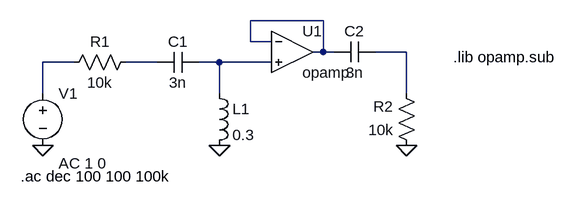
[diagram p0: schematic pasivo.asc]
pasivo.asc, the LTspice schematic file:
Version 4
SHEET 1 880 680
WIRE 320 0 208 0
WIRE 208 32 208 0
WIRE 240 32 208 32
WIRE 320 48 320 0
WIRE 320 48 304 48
WIRE 336 48 320 48
WIRE 448 48 400 48
WIRE -64 64 -112 64
WIRE 64 64 16 64
WIRE 160 64 128 64
WIRE 240 64 160 64
WIRE -112 112 -112 64
WIRE 160 112 160 64
WIRE 448 112 448 48
FLAG -112 192 0
FLAG 448 192 0
FLAG 160 192 0
SYMBOL res 32 48 R90
WINDOW 0 0 56 VBottom 2
WINDOW 3 32 56 VTop 2
SYMATTR InstName R1
SYMATTR Value 10k
SYMBOL res 464 208 R180
WINDOW 0 36 76 Left 2
WINDOW 3 36 40 Left 2
SYMATTR InstName R2
SYMATTR Value 10k
SYMBOL cap 128 48 R90
WINDOW 0 0 32 VBottom 2
WINDOW 3 32 32 VTop 2
SYMATTR InstName C1
SYMATTR Value 3n
SYMBOL cap 400 32 R90
WINDOW 0 0 32 VBottom 2
WINDOW 3 32 32 VTop 2
SYMATTR InstName C2
SYMATTR Value 3n
SYMBOL ind 144 96 R0
SYMATTR InstName L1
SYMATTR Value 0.3
SYMBOL Opamps\\opamp 272 -16 R0
SYMATTR InstName U1
SYMBOL voltage -112 96 R0
WINDOW 123 24 124 Left 2
WINDOW 39 0 0 Left 2
SYMATTR InstName V1
SYMATTR Value ""
SYMATTR Value2 AC 1 0
TEXT 520 56 Left 2 !.lib opamp.sub
TEXT -146 240 Left 2 !.ac dec 100 100 100k

The netlist it stands for:
* pasivo.asc
R1 N004 N003 10k
R2 0 N002 10k
C1 N005 N004 3n
C2 N002 N001 3n
L1 N005 0 0.3
XU1 N001 N005 N001 opamp Aol=100K GBW=10Meg  ; pins invin noninvin out
V1 N003 0 AC 1 0
.lib opamp.sub
.ac dec 100 100 100k
.backanno
.end